# Altium schematic sheet soldier_BoardInterfaces.SchDoc
size Tabloid; SheetNumber: 2; SheetTotal: 6
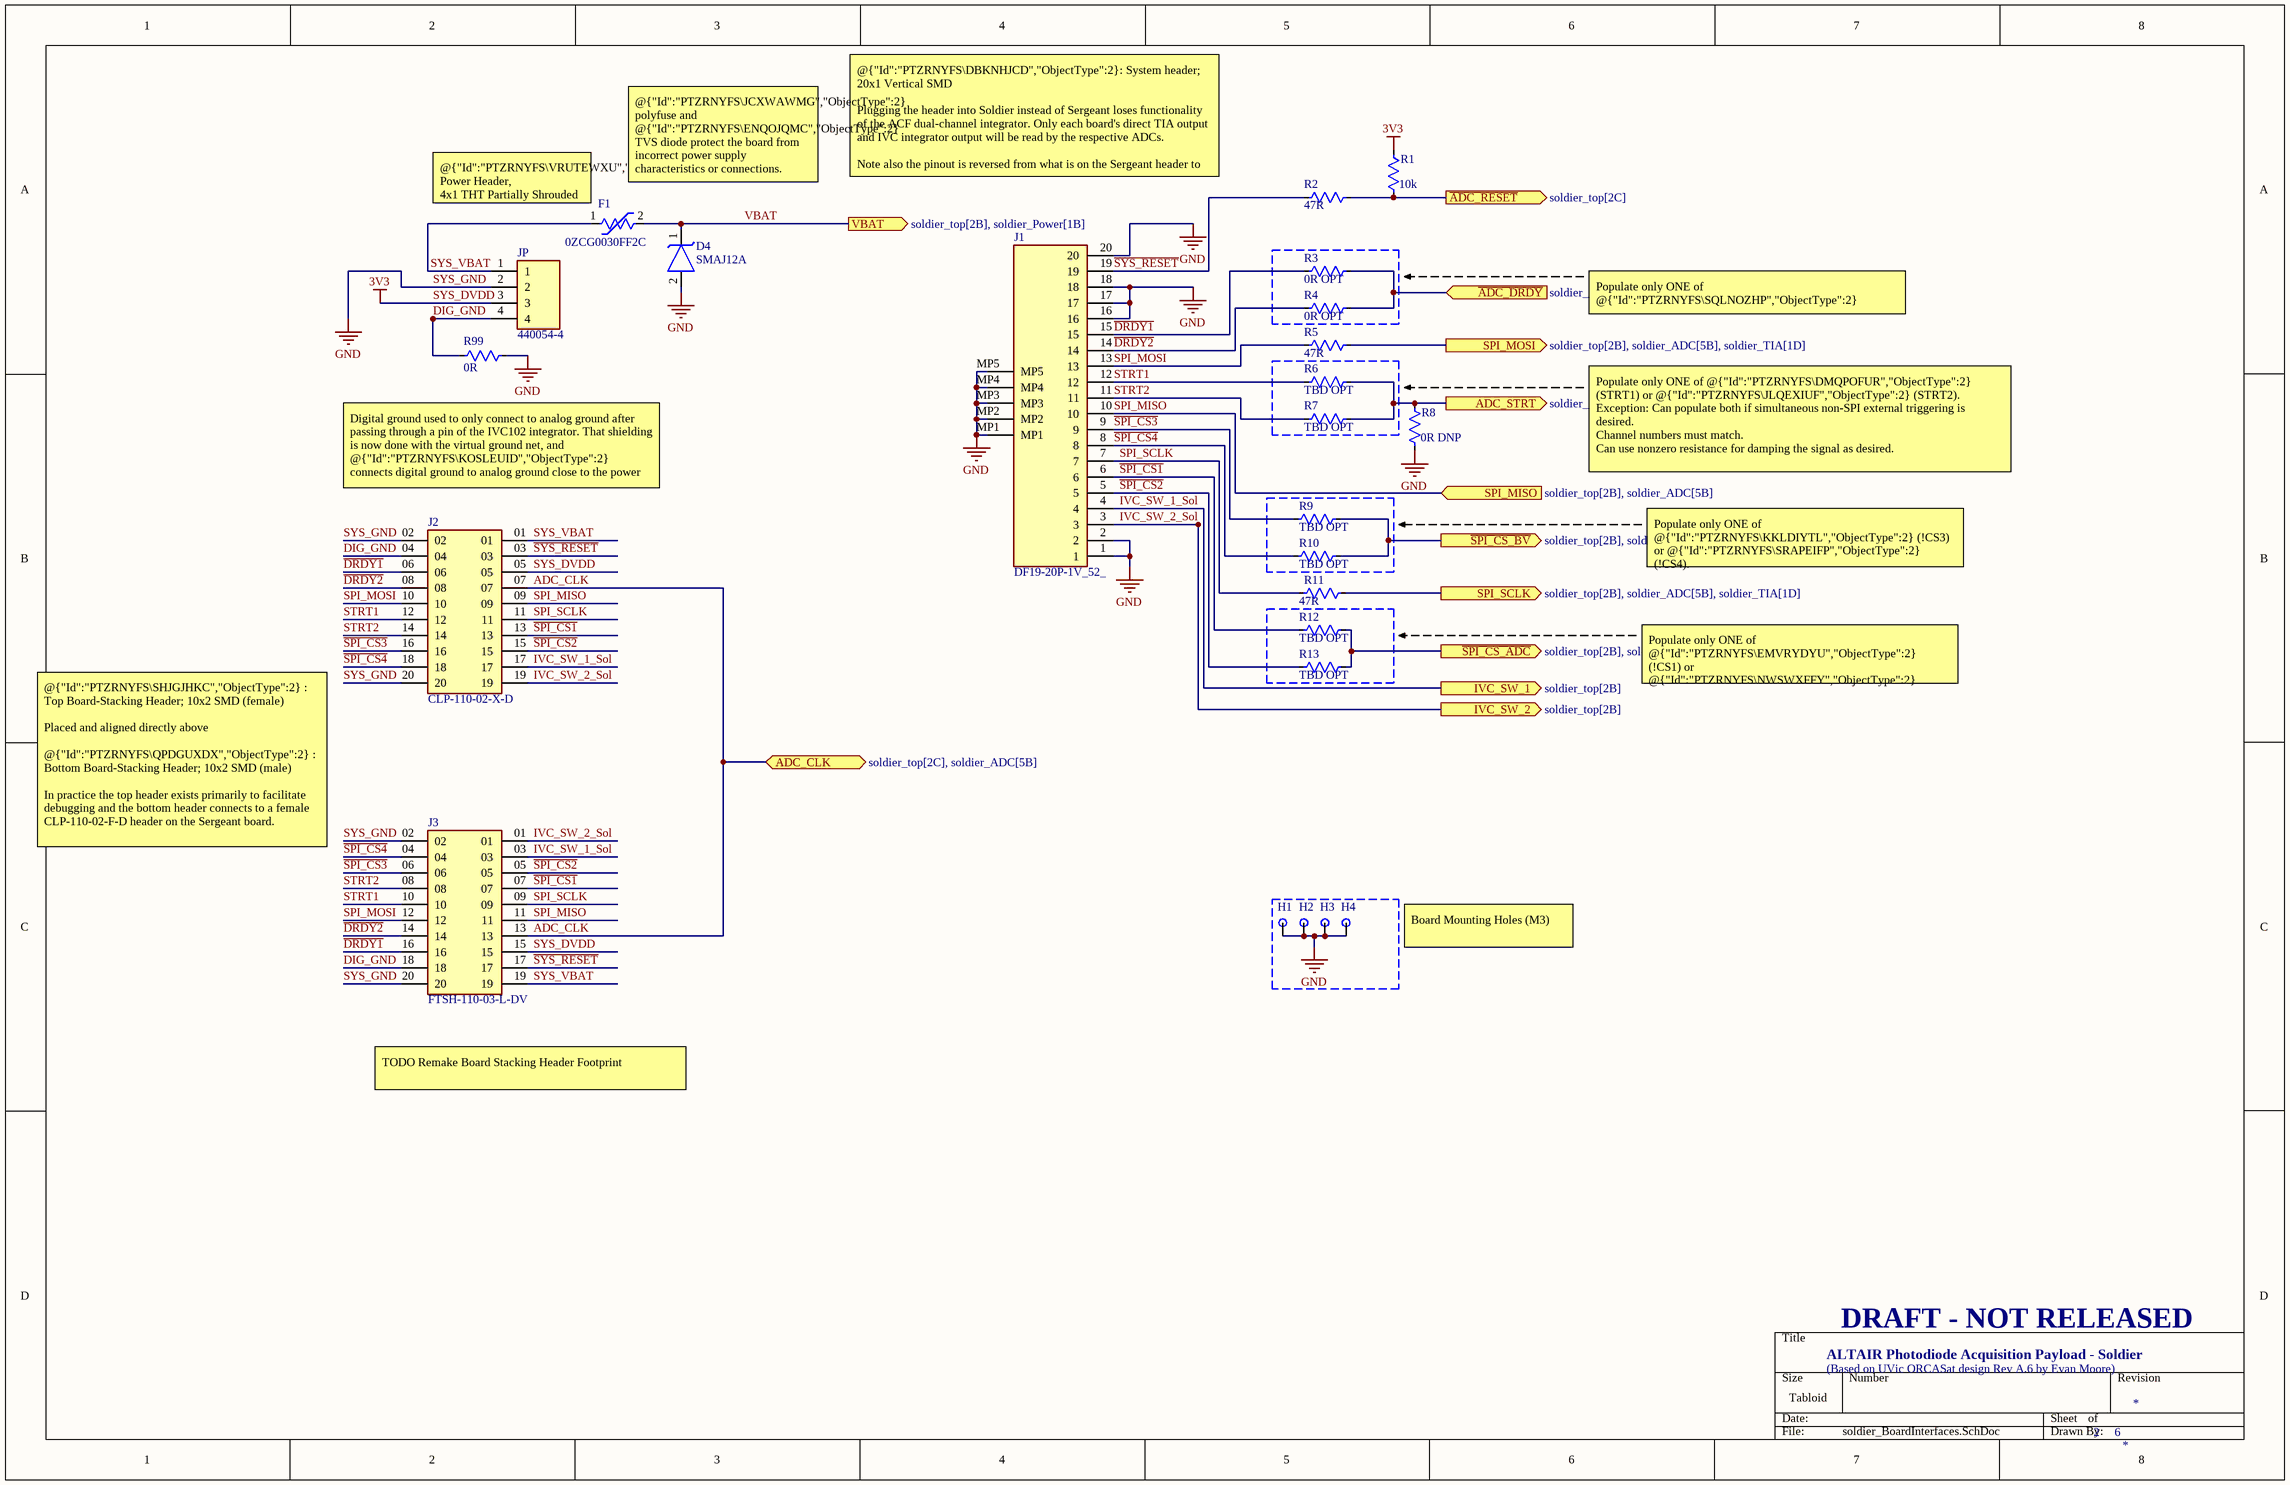
[diagram p0: soldier_BoardInterfaces.SchDoc]

## Parts
D4  SMAJ12A  [DO-214AC SMA VISHAY]
F1  0ZCG0030FF2C  [POLYFUSE 1812 NON-IPC BELFUSE]
H1  Mount-hole  [M3 PTH FOR 4.5MM HEX]  (value not drawn)  (no BOM)
H2  Mount-hole  [M3 PTH FOR 4.5MM HEX]  (value not drawn)  (no BOM)
H3  Mount-hole  [M3 PTH FOR 4.5MM HEX]  (value not drawn)  (no BOM)
H4  Mount-hole  [M3 PTH FOR 4.5MM HEX]  (value not drawn)  (no BOM)
J1  DF19-20P-1V_52_  [HEADER MALE 20x1 1MM PITCH SMD]
J2  CLP-110-02-X-D  [HEADER FEMALE 10X2 1.27MM PITCH SMD]
J3  FTSH-110-03-L-DV  [HEADER MALE 10X2 1.27MM PITCH FTSH]
JP  440054-4  [HEADER MALE 4x1 2MM PITCH THT]
R1  10k  [RES 0603 IPC MID DENSITY]
R2  47R  [RES 0402 NON-IPC SEI]
R3  0R OPT  [RES 0402 IPC MID DENSITY]
R4  0R OPT  [RES 0402 IPC MID DENSITY]
R5  47R  [RES 0402 NON-IPC SEI]
R6  TBD OPT  [RES 0402 IPC MID DENSITY]
R7  TBD OPT  [RES 0402 IPC MID DENSITY]
R8  0R DNP  [RES 0603 IPC MID DENSITY]
R9  TBD OPT  [RES 0402 IPC MID DENSITY]
R10  TBD OPT  [RES 0402 IPC MID DENSITY]
R11  47R  [RES 0402 NON-IPC SEI]
R12  TBD OPT  [RES 0402 IPC MID DENSITY]
R13  TBD OPT  [RES 0402 IPC MID DENSITY]
R99  0R  [RES 0402 IPC MID DENSITY]

## Ports
ADC_CLK (bidir, see soldier_top[2C], soldier_ADC[5B]), ADC_STRT (out, see soldier_top[2C]), IVC_SW_1 (out, see soldier_top[2B]), IVC_SW_2 (out, see soldier_top[2B]), SPI_MISO (in, see soldier_top[2B], soldier_ADC[5B]), SPI_MOSI (out, see soldier_top[2B], soldier_ADC[5B], soldier_TIA[1D]), SPI_SCLK (out, see soldier_top[2B], soldier_ADC[5B], soldier_TIA[1D]), VBAT (out, see soldier_top[2B], soldier_Power[1B]), ~{ADC_DRDY} (in, see soldier_top[2C]), ~{ADC_RESET} (out, see soldier_top[2C]), ~{SPI_CS_ADC} (out, see soldier_top[2B], soldier_ADC[5B]), ~{SPI_CS_BV} (out, see soldier_top[2B], soldier_TIA[1D])

## Nets
SYS_DVDD: J2.05 J3.15 JP.3 R1.1  [also labelled 3V3]
SYS_GND: D4.2(Anode) H1.1 H2.1 H3.1 H4.1 J1.1 J1.2 J1.16 J1.17 J1.18 J1.20 J1.MP1 J1.MP2 J1.MP3 J1.MP4 J1.MP5 J2.02 J2.20 J3.02 J3.20 JP.2 R8.2 R99.1  [also labelled GND]
~{ADC_DRDY}: R3.2 R4.2 ; port ~{ADC_DRDY}
~{ADC_RESET}: R1.2 R2.2 ; port ~{ADC_RESET}
~{DRDY1}: J1.15 J2.06 J3.16 R3.1
~{DRDY2}: J1.14 J2.08 J3.14 R4.1
~{SPI_CS1}: J1.6 J2.13 J3.07 R12.1
~{SPI_CS2}: J1.5 J2.15 J3.05 R13.1
~{SPI_CS3}: J1.9 J2.16 J3.06 R9.1
~{SPI_CS4}: J1.8 J2.18 J3.04 R10.1
~{SPI_CS_ADC}: R12.2 R13.2 ; port ~{SPI_CS_ADC}
~{SPI_CS_BV}: R9.2 R10.2 ; port ~{SPI_CS_BV}
~{SYS_RESET}: J1.19 J2.03 J3.17 R2.1
ADC_CLK: J2.07 J3.13 ; port ADC_CLK
ADC_STRT: R6.2 R7.2 R8.1 ; port ADC_STRT
DIG_GND: J2.04 J3.18 JP.4 R99.2
IVC_SW_1_Sol: J1.4 J2.17 J3.03 ; port IVC_SW_1
IVC_SW_2_Sol: J1.3 J2.19 J3.01 ; port IVC_SW_2
SPI_MISO: J1.10 J2.09 J3.11 ; port SPI_MISO
SPI_MOSI: J1.13 J2.10 J3.12 R5.1
SPI_MOSI: R5.2 ; port SPI_MOSI  [a separate net that carries the same name]
SPI_SCLK: J1.7 J2.11 J3.09 R11.1
SPI_SCLK: R11.2 ; port SPI_SCLK  [a separate net that carries the same name]
STRT1: J1.12 J2.12 J3.10 R6.1
STRT2: J1.11 J2.14 J3.08 R7.1
SYS_VBAT: F1.1 J2.01 J3.19 JP.1
VBAT: D4.1(Cathode) F1.2 ; port VBAT

## Notes on the sheet
- (near F1) @{"Id":"PTZRNYFS\VRUTEWXU","ObjectType":2} Power Header,
  4x1 THT Partially Shrouded
- @{"Id":"PTZRNYFS\JCXWAWMG","ObjectType":2} polyfuse and @{"Id":"PTZRNYFS\ENQOJQMC","ObjectType":2} TVS diode protect the board from incorrect power supply characteristics or connections.
  Rated for up to 14V and 300mA.
- @{"Id":"PTZRNYFS\DBKNHJCD","ObjectType":2}: System header; 20x1 Vertical SMD
  Plugging the header into Soldier instead of Sergeant loses functionality of the ACF dual-channel integrator. Only each board's direct TIA output and IVC integrator output will be read by the respective ADCs.
  Note also the pinout is reversed from what is on the Sergeant header to make routing the PCB tractable.
- Populate only ONE of @{"Id":"PTZRNYFS\SQLNOZHP","ObjectType":2} (!DRDY1) or @{"Id":"PTZRNYFS\BBASJRRG","ObjectType":2} (!DRDY2).
  Channel numbers must match.
- Digital ground used to only connect to analog ground after passing through a pin of the IVC102 integrator. That shielding is now done with the virtual ground net, and @{"Id":"PTZRNYFS\KOSLEUID","ObjectType":2} connects digital ground to analog ground close to the power header.
- Populate only ONE of @{"Id":"PTZRNYFS\DMQPOFUR","ObjectType":2} (STRT1) or @{"Id":"PTZRNYFS\JLQEXIUF","ObjectType":2} (STRT2).
  Exception: Can populate both if simultaneous non-SPI external triggering is desired.
  Channel numbers must match.
  Can use nonzero resistance for damping the signal as desired.
  Populate @{"Id":"PTZRNYFS\PRXHVUPJ","ObjectType":2} if configuring ADC conversion through SPI commands instead.
- Populate only ONE of @{"Id":"PTZRNYFS\KKLDIYTL","ObjectType":2} (!CS3) or @{"Id":"PTZRNYFS\SRAPEIFP","ObjectType":2} (!CS4).
  Channel numbers must match.
  Can use nonzero resistance for damping the signal as desired.
- Populate only ONE of @{"Id":"PTZRNYFS\EMVRYDYU","ObjectType":2} (!CS1) or @{"Id":"PTZRNYFS\NWSWXFFY","ObjectType":2} (!CS2).
  Channel numbers must match.
  Can use nonzero resistance for damping the signal as desired.
- @{"Id":"PTZRNYFS\SHJGJHKC","ObjectType":2} : Top Board-Stacking Header; 10x2 SMD (female)
  Placed and aligned directly above
  @{"Id":"PTZRNYFS\QPDGUXDX","ObjectType":2} : Bottom Board-Stacking Header; 10x2 SMD (male)
  In practice the top header exists primarily to facilitate debugging and the bottom header connects to a female CLP-110-02-F-D header on the Sergeant board.
  Previously, the Specialist board was also part of the stack, but the tall relays make this impractical.
- Board Mounting Holes (M3)
- TODO Remake Board Stacking Header Footprint
- ALTAIR Photodiode Acquisition Payload - Soldier
- (Based on UVic ORCASat design Rev A.6 by Evan Moore)
- DRAFT - NOT RELEASED

## Library data of the parts
D4 = Zener: Vishay SMAJ12A-M3/61 - TVS Diode 12V Standoff 13.3V Breakdown DO-214AC; MF: Vishay General Semiconductor; MP: SMAJ12A-M3/61
F1 = Polyfuse: Bel Fuse 0ZCG0030FF2C - Polymeric PTC Resettable Fuse 30V 300mA hold 600mA trip SMD 1812; MF: Bel Fuse Inc.; MP: 0ZCG0030FF2C
H1-H4 = Mount-hole: (Plated) Mounting hole
J1 = DF19-20P-1V_52_: 20x1 Header SMD; MF: Hirose; MP: DF19-20P-1V(52); Datasheet Link: https://www.hirose.com/en/product/document?clcode=CL0685-0037-0-52&productname=DF19-20P-1V(52)&series=DF19&documenttype=2DDrawing&lang=en&documentid=0001394451; Height: 5.37mm; Mouser Part Number: 798-DF1920P1V52; Mouser Price/Stock: https://www.mouser.co.uk/ProductDetail/Hirose-Connector/DF19-20P-1V52?qs=QNEnbhJQKvayaXitD7MtBA%3D%3D
J2 = CLP-110-02-X-D: 10x2 Stacking Header SMD / 20 Position Receptacle Connector 0.050 (1.27mm) Surface Mount, Right Angle Gold; MF: Samtec; MP: CLP-110-02-L-D; SnapEDA_Link: https://www.snapeda.com/parts/CLP-110-02-L-D/Samtec/view-part/?ref=snap; Package: None; Value: *; Check_prices: https://www.snapeda.com/parts/CLP-110-02-L-D/Samtec/view-part/?ref=eda
J3 = CLP-110-02-X-D: 10x2 Position Pin Connector 0.050 (1.27mm) Surface Mount, Gold; Alt parts FTSH-110-03-F-DV (thinner gold), FTSH-110-03-F-DV-P (thinner gold + pick and place); MF: Samtec; MP: FTSH-110-03-L-DV
JP = 440054-4: 4x1 Header SMD Partial Shroud; MF: TE Connectivity; Datasheet Link: https://www.te.com/commerce/DocumentDelivery/DDEController?Action=srchrtrv&DocNm=1-1773713-2_HPI_QRG_EN&DocType=Data%20Sheet&DocLang=English&PartCntxt=440054-4&DocFormat=pdf; Height: 6.35mm; MP: 440054-4; Mouser Part Number: 571-440054-4; Mouser Price/Stock: https://www.mouser.co.uk/ProductDetail/TE-Connectivity/440054-4?qs=JFPmFzpscO7310iGSDds%2FA%3D%3D; Arrow Part Number: 440054-4; Arrow Price/Stock: https://www.arrow.com/en/products/440054-4/te-connectivity?utm_currency=USD&region=europe
R1 = RES: Vishay CRCW060310K0FKEA SMD 0603 10k, CRCW e3 Series, 75V, thick film, 100mW; MF: Vishay Dale; MP: CRCW060310K0FKEA
R2 R5 R11 = RES: Stackpole RMCF0402JT47R0 - Res 47Ohm 5% 0.063W 0402 Thick Film AEC-Q200 compliant; MF: Stackpole Electronics Inc.; MP: RMCF0402JT47R0
R3 R4 R8 R99 = RES: Yageo RC0402JR-070RL - Res 0 Ohms 1/16W SMD 0402; MF: YAGEO; MP: RC0402JR-070RL
R6 R7 R9 R10 R12 R13 = RES: Stackpole RMCF0402JT47R0 - Res 47Ohm 5% 0.063W 0402 Thick Film AEC-Q200 compliant (Placeholder); MF: Stackpole Electronics Inc.; MP: RMCF0402JT47R0